# Altium schematic sheet MCU.SchDoc
size A4; Organization: Altium Limited; Address1: L3, 12a Rodborough Rd; Address2: Frenchs Forest; Address3: NSW; Address4: Australia 2086
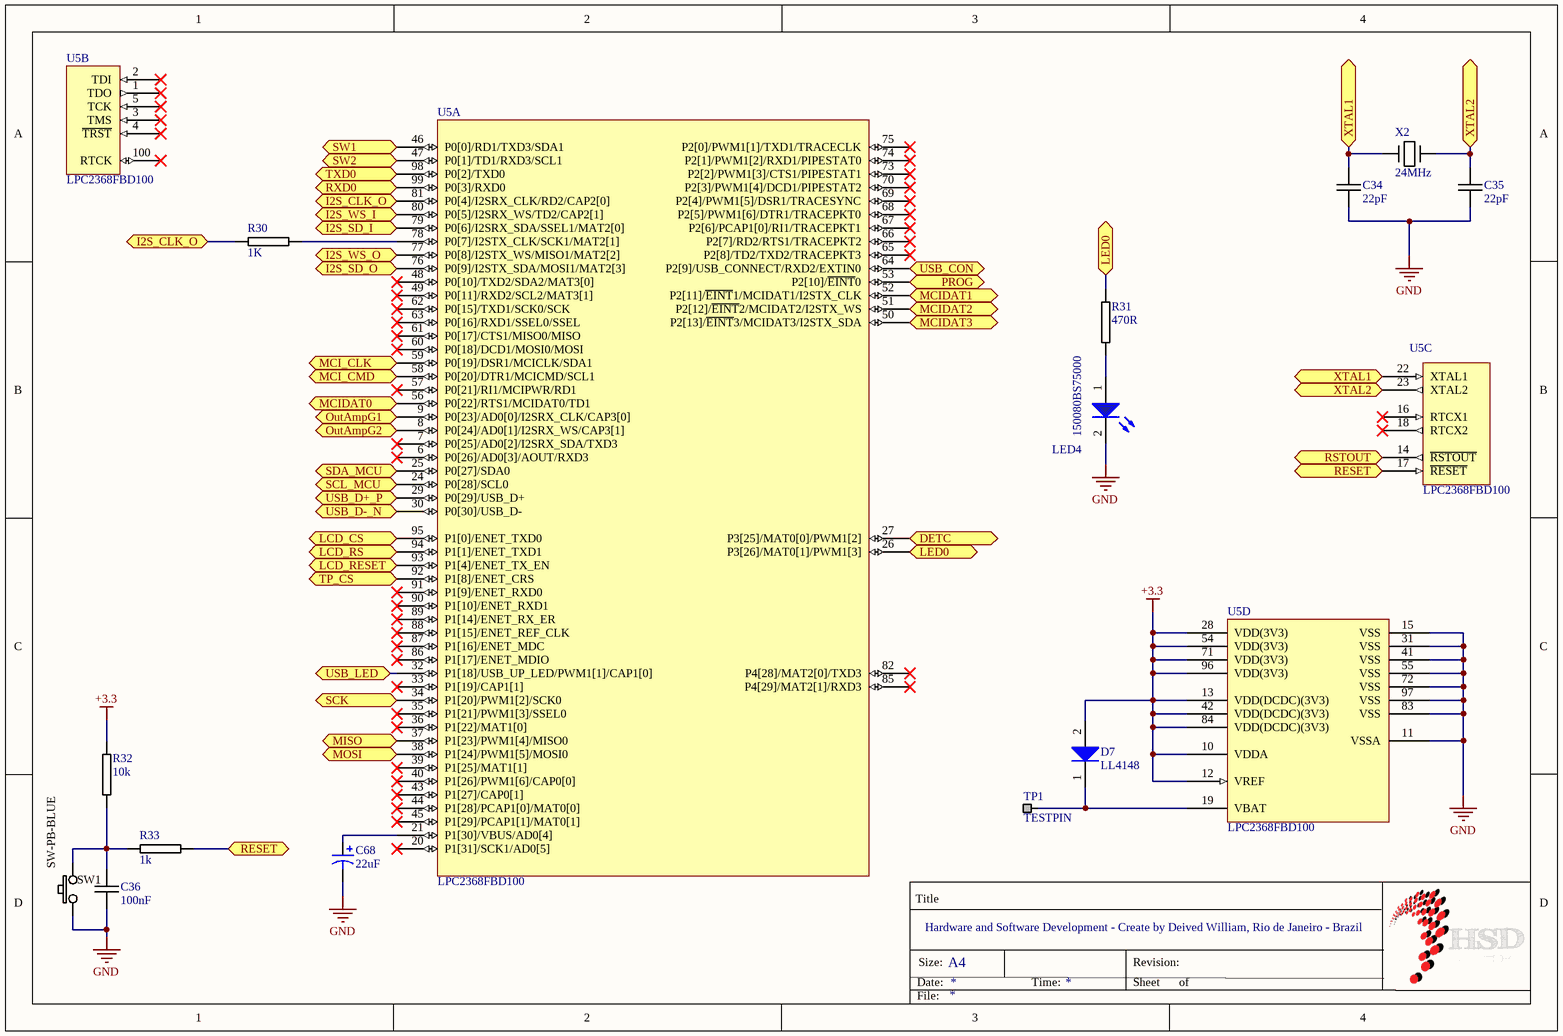
[diagram p0: MCU.SchDoc]

## Parts
C34  22pF  [0603C-GENERIC]
C35  22pF  [0603C-GENERIC]
C36  100nF  [0603C-GENERIC]
C68  22uF  [D]
D7  LL4148  [MELFDIODE]
LED4  150080BS75000  [LED_0805_Blue]
R30  1K  [0603R-1k]
R31  470R  [0603R-1k]
R32  10k  [0603R-100]
R33  1k  [0603R-100]
SW1  SW-PB-BLUE  [SW-PB-BLUE-ROUND4]
TP1  TESTPIN  [TESTPIN]
U5  LPC2368FBD100  [SOT407-1_N]  (parts A,B,C,D of 4)
X2  24MHz  [XTAL-RU49/4]

## Ports
DETC, I2S_CLK_O, I2S_SD_I, I2S_SD_O, I2S_WS_I, I2S_WS_O, LCD_CS, LCD_RESET, LCD_RS, LED0, MCI_CLK, MCI_CMD, MCIDAT0, MCIDAT1, MCIDAT2, MCIDAT3, MISO, MOSI, OutAmpG1, OutAmpG2, PROG, RESET, RSTOUT, RXD0, SCK, SCL_MCU, SDA_MCU, SW1, SW2, TP_CS, TXD0, USB_CON, USB_D+_P, USB_D-_N, USB_LED, XTAL1, XTAL2

## Nets
+3.3: D7.2(A) R32.2 U5.10(VDDA) U5.12(VREF) U5.13(VDD(DCDC)(3V3)) U5.28(VDD(3V3)) U5.42(VDD(DCDC)(3V3)) U5.54(VDD(3V3)) U5.71(VDD(3V3)) U5.84(VDD(DCDC)(3V3)) U5.96(VDD(3V3))
GND: C34.2 C35.2 C36.2 C68.2 LED4.2(C) SW1.1 U5.11(VSSA) U5.15(VSS) U5.31(VSS) U5.41(VSS) U5.55(VSS) U5.72(VSS) U5.83(VSS) U5.97(VSS)
DETC: U5.27(P3[25]/MAT0[0]/PWM1[2]) ; port DETC
I2S_CLK_O: R30.1 U5.81(P0[4]/I2SRX_CLK/RD2/CAP2[0]) ; port I2S_CLK_O
I2S_SD_I: U5.79(P0[6]/I2SRX_SDA/SSEL1/MAT2[0]) ; port I2S_SD_I
I2S_SD_O: U5.76(P0[9]/I2STX_SDA/MOSI1/MAT2[3]) ; port I2S_SD_O
I2S_WS_I: U5.80(P0[5]/I2SRX_WS/TD2/CAP2[1]) ; port I2S_WS_I
I2S_WS_O: U5.77(P0[8]/I2STX_WS/MISO1/MAT2[2]) ; port I2S_WS_O
LCD_CS: U5.95(P1[0]/ENET_TXD0) ; port LCD_CS
LCD_RESET: U5.93(P1[4]/ENET_TX_EN) ; port LCD_RESET
LCD_RS: U5.94(P1[1]/ENET_TXD1) ; port LCD_RS
LED0: R31.1 U5.26(P3[26]/MAT0[1]/PWM1[3]) ; port LED0
MCI_CLK: U5.59(P0[19]/DSR1/MCICLK/SDA1) ; port MCI_CLK
MCI_CMD: U5.58(P0[20]/DTR1/MCICMD/SCL1) ; port MCI_CMD
MCIDAT0: U5.56(P0[22]/RTS1/MCIDAT0/TD1) ; port MCIDAT0
MCIDAT1: U5.52(P2[11]/~{EINT}1/MCIDAT1/I2STX_CLK) ; port MCIDAT1
MCIDAT2: U5.51(P2[12]/~{EINT}2/MCIDAT2/I2STX_WS) ; port MCIDAT2
MCIDAT3: U5.50(P2[13]/~{EINT}3/MCIDAT3/I2STX_SDA) ; port MCIDAT3
MISO: U5.37(P1[23]/PWM1[4]/MISO0) ; port MISO
MOSI: U5.38(P1[24]/PWM1[5]/MOSI0) ; port MOSI
OutAmpG1: U5.9(P0[23]/AD0[0]/I2SRX_CLK/CAP3[0]) ; port OutAmpG1
OutAmpG2: U5.8(P0[24]/AD0[1]/I2SRX_WS/CAP3[1]) ; port OutAmpG2
PROG: U5.53(P2[10]/~{EINT}0) ; port PROG
RESET: R33.2 U5.17(~{RESET}) ; port RESET
RSTOUT: U5.14(~{RSTOUT}) ; port RSTOUT
RXD0: U5.99(P0[3]/RXD0) ; port RXD0
SCK: U5.34(P1[20]/PWM1[2]/SCK0) ; port SCK
SCL_MCU: U5.24(P0[28]/SCL0) ; port SCL_MCU
SDA_MCU: U5.25(P0[27]/SDA0) ; port SDA_MCU
SW1: U5.46(P0[0]/RD1/TXD3/SDA1) ; port SW1
SW2: U5.47(P0[1]/TD1/RXD3/SCL1) ; port SW2
TP_CS: U5.92(P1[8]/ENET_CRS) ; port TP_CS
TXD0: U5.98(P0[2]/TXD0) ; port TXD0
USB_CON: U5.64(P2[9]/USB_CONNECT/RXD2/EXTIN0) ; port USB_CON
USB_D+_P: U5.29(P0[29]/USB_D+) ; port USB_D+_P
USB_D-_N: U5.30(P0[30]/USB_D-) ; port USB_D-_N
USB_LED: U5.32(P1[18]/USB_UP_LED/PWM1[1]/CAP1[0]) ; port USB_LED
XTAL1: C34.1 U5.22(XTAL1) X2.1 ; port XTAL1
XTAL2: C35.1 U5.23(XTAL2) X2.2 ; port XTAL2
NetC36_1: C36.1 R32.1 R33.1 SW1.2
NetC68_1: C68.1 U5.21(P1[30]/VBUS/AD0[4])
NetD7_1: D7.1(K) TP1.1 U5.19(VBAT)
NetLED4_1: LED4.1(A) R31.2
NetR30_2: R30.2 U5.78(P0[7]/I2STX_CLK/SCK1/MAT2[1])

Not connected (* = marked no-connect by the designer): U5 1(TDO)* 2(TDI)* 3(TMS)* 4(~{TRST})* 5(TCK)* 6(P0[26]/AD0[3]/AOUT/RXD3)* 7(P0[25]/AD0[2]/I2SRX_SDA/TXD3)* 16(RTCX1)* 18(RTCX2)* 20(P1[31]/SCK1/AD0[5])* 33(P1[19]/CAP1[1])* 35(P1[21]/PWM1[3]/SSEL0)* 36(P1[22]/MAT1[0])* 39(P1[25]/MAT1[1])* 40(P1[26]/PWM1[6]/CAP0[0])* 43(P1[27]/CAP0[1])* 44(P1[28]/PCAP1[0]/MAT0[0])* 45(P1[29]/PCAP1[1]/MAT0[1])* 48(P0[10]/TXD2/SDA2/MAT3[0])* 49(P0[11]/RXD2/SCL2/MAT3[1])* 57(P0[21]/RI1/MCIPWR/RD1)* 60(P0[18]/DCD1/MOSI0/MOSI)* 61(P0[17]/CTS1/MISO0/MISO)* 62(P0[15]/TXD1/SCK0/SCK)* 63(P0[16]/RXD1/SSEL0/SSEL)* 65(P2[8]/TD2/TXD2/TRACEPKT3)* 66(P2[7]/RD2/RTS1/TRACEPKT2)* 67(P2[6]/PCAP1[0]/RI1/TRACEPKT1)* 68(P2[5]/PWM1[6]/DTR1/TRACEPKT0)* 69(P2[4]/PWM1[5]/DSR1/TRACESYNC)* 70(P2[3]/PWM1[4]/DCD1/PIPESTAT2)* 73(P2[2]/PWM1[3]/CTS1/PIPESTAT1)* 74(P2[1]/PWM1[2]/RXD1/PIPESTAT0)* 75(P2[0]/PWM1[1]/TXD1/TRACECLK)* 82(P4[28]/MAT2[0]/TXD3)* 85(P4[29]/MAT2[1]/RXD3)* 86(P1[17]/ENET_MDIO)* 87(P1[16]/ENET_MDC)* 88(P1[15]/ENET_REF_CLK)* 89(P1[14]/ENET_RX_ER)* 90(P1[10]/ENET_RXD1)* 91(P1[9]/ENET_RXD0)* 100(RTCK)*

## Notes on the sheet
- Title
- Date:
- Size:
- Hardware and Software Development - Create by Deived William, Rio de Janeiro - Brazil
- A4
- Time:
- Revision:
- Sheet
- of
- File:

## Library data of the parts
C34 C35 = 0603C-22PF-50V-C0G-PAN: CAPACITOR 0603 CERAMIC; Manufacturer Part Number: ECJ-1VC1H220J; Manufacturer: Panasonic - ECG; Reel: C10; Tolerance: ±5%; Temperature Coefficient: C0G, NP0; Voltage - Rated: 50V; Supplier 1: Digi-Key; Features: General Purpose; Lead Spacing: -; Supplier: Digi-Key; Capacitance: 22pF; Packaging: Tape & Reel (TR); Mounting Type: Surface Mount, MLCC; RoHS: RoHS Compliant; Operating Temperature: -55°C ~ 125°C; Thickness: 0.80mm; Package / Case: 0603 (1608 metric); Category: Capacitors; Supplier Part Number 1: PCC220ACVTR-ND; Supplier Part Number: PCC220ACVTR-ND
C36 = 0603C-100NF-25V-X7R-TDK: CAPACITOR 0603 CERAMIC; Manufacturer Part Number: C1608X7R1E104K; Manufacturer: TDK Corporation; Reel: C12; Supplier 1: Digi-Key; Supplier Part Number 1: 445-1316-2-ND
C68 = CC106D004M: Conformal Coated Solid Tantalum Chip Capacitor: Standard Range, 10uF, 20% Tolerance, 4 WVDC @ -55°C to +85°C, Surge = 5V; Note: See Data Sheet for full range of components; Published: 19-Mar-2004; DatasheetDocument: 21-Mar-2002; PackageReference: D; Publisher: Altium Limited; ComponentLink1Description: Manufacturer Link; ComponentLink1URL: http://www.vishay.com/; ComponentLink2Description: Datasheet; ComponentLink2URL: http://www.vishay.com/docs/43017/ccec.pdf; Value: 10uF
D7 = 1N4148: Small Signal Fast Switching Diode
LED4 = WL-SMCW 0805  150080BS75000: SMD mono-color Chip LED, WL-SMCW, Blue; Manufacturer: W黵th Elektronik eiSos GmbH; PartNo: 150080BS75000; ComponentLink1Description: Manufacturer; ComponentLink1URL: http://www.we-online.de; Created by: Christin Otto; Created Date: June 2013; ComponentLink2Description: Datasheet; ComponentLink2URL: http://katalog.we-online.com/led/datasheet/150080BS75000.pdf; Color: Blue
R30 R31 = 0603R-1K: GENERIC RESISTOR 0603; Manufacturer Part Number: RMCF 1/16 1K 1% R; Manufacturer: Stackpole Electronics Inc; Reel: R14; Supplier 1: Digi-Key; Supplier Part Number 1: RMCF0603FT1K00TR-ND
R32 R33 = 0603R-100: GENERIC RESISTOR 0603; Manufacturer Part Number: RMCF 1/16 100 1% R; Manufacturer: Stackpole Electronics Inc; Reel: R24; Supplier 1: Digi-Key; Supplier Part Number 1: RMCF1/16100FRDKR-ND
SW1 = SW-PB-BLUE: SW-D6-R / SW-DS-S / SW-14X14 / SW-7X7
TP1 = TESTPIN: TESTPIN SINGLE PIN HEADER; Manufacturer 1: Sharon Long Industries; Manufacturer Part Number 1: Cut-it-yourself; Reel: TH; Supplier 1: Sharon Long Industries; Supplier 1 Part number: Cut-It-Yourself
U5 = LPC2368FBD100: ARM7 16/32-Bit Microcontroller, 512KB Flash, 58KB RAM, 4 Channel CAN, 100-Lead LQFP; Code_IEC: 136E20; Published: 17-Aug-2007; DatasheetVersion: rev.01, Jan-2007; PackageVersion: Feb-2003; PackageReference: SOT407-1; Publisher: Altium Limited; PackageDescription: 100-Pin Plastic Low Profile Quad Flat Pack, LQFP100; Code_JEDEC: MS-026; ComponentLink1Description: Manufacturer Link; ComponentLink1URL: http://www.nxp.com/; ComponentLink2Description: Datasheet; ComponentLink2URL: http://www.standardics.nxp.com/products/lpc2000/datasheet/lpc2364.lpc2366.lpc2368.pdf
X2 = 16MC-HC49US: 16MHZ CRSYTAL HC49US; Supplier 1: Mouser; Supplier Part Number 1: 815-ABLS-16.0M-T